# Altium schematic sheet sintez4355.SchDoc: Синтезатор 4355
size 840 x 594 mm; ApprovedBy: Демьяненко; CheckedBy: Быкадоров; Author: Юдин; DrawnBy: Юдин; Engineer: Нач. сек.; DocumentNumber: ЛБИЮ.0006 Э3; SheetTotal: 1; PageSetup: Record=PageOptions|CenterHorizontal=False|CenterVertical=False|PrintScale=0.33|XCorrection=0.00|YCorrection=0.00|PrintKind=1|BorderSize=5000000|LeftOffset=0|BottomOffset=0|Orientation=1|PaperLength=1000|PaperWidth=1000|Scale=100|PaperSource=15|PrintQuality=600|MediaType=1|DitherType=10|PaperKind=A4|PrintScaleMode=1; EngineerName: Быкадоров; DocumentType1str: Схема электрическая; DocumentType2str: принципиальная; NachKonstrSekt: Деплова; NachSektNadezn: Сагакянц; NachPodrVydTz: Бутко; ZamPoKonstr: Беликов; CRC32: A0E1A165; Обозначение: ЛБИЮ.0006 Э3; DOC_ID: 24763; шифр заказа: "Пх"; Номер версии: 0; Имя файла: sintez4355.SchDoc; Место хранения рабочей копии: E:\PROJECTS\SVN ФОРМИРОВАТЕЛИ ЧАСТОТЫ МИКРАН\MIKRAN 3; Владелец: Юдин Д.Г.; Дата создания документа: 26.01.2018; Тип документа: Э3 Схема электрическая Altium; Тип документа1: Cхема электрическая принципиальная; Архив: 2931; Масса: 0; Единица измерения: кг; Раздел СП: Документация; Статус ОТД: Не зарегистрирован; Наименование: Синртезатор 4355; ImagePath: ЛБИЮ.464345.028; Rule: PcbType=ProtelPcb
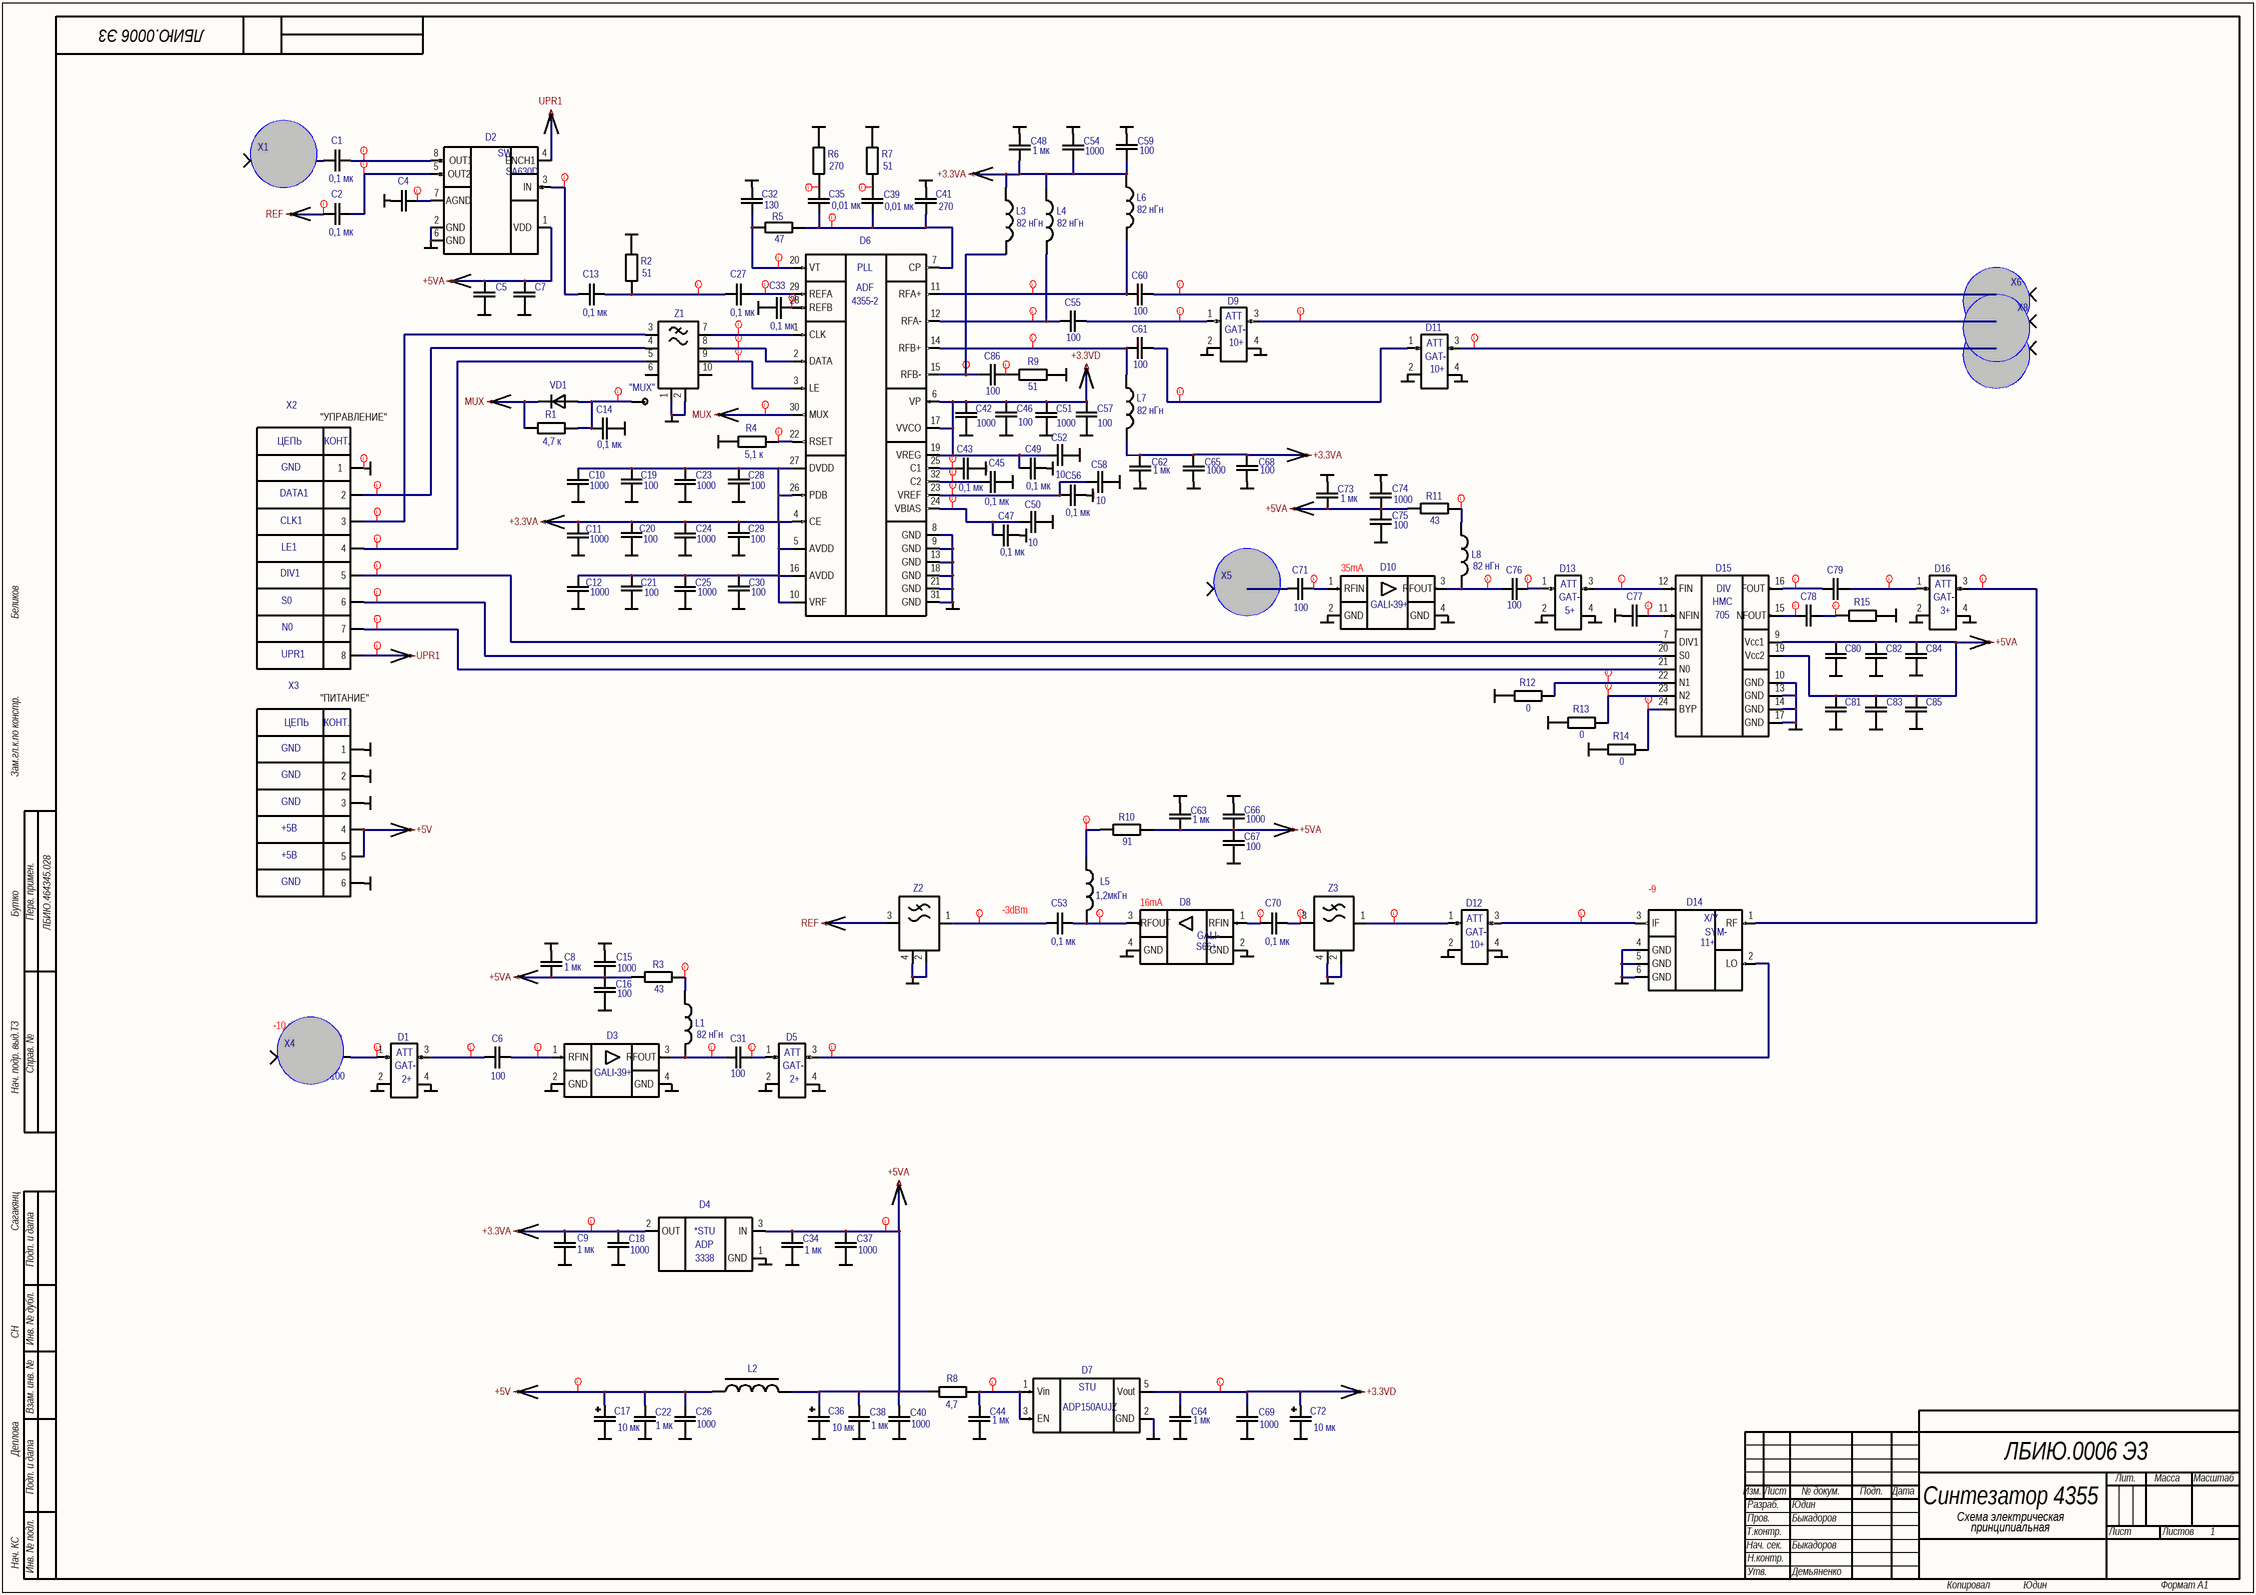
[diagram p0: sintez4355.SchDoc]

## Parts
(Parts that share a designator on the sheet are numbered #1, #2 ... from top to bottom, then left to right.)
1  TP  [TP0.3]  (value not drawn)  (no BOM)
*#1  VCC  (value not drawn)  (graphical)
*#2  GND  (value not drawn)  (graphical)
*#3  GND  (value not drawn)  (graphical)
*#4  GND  (value not drawn)  (graphical)
*#5  GND  (value not drawn)  (graphical)
*#6  GND  (value not drawn)  (graphical)
*#7  VCC  (value not drawn)  (graphical)
*#8  GND  (value not drawn)  (graphical)
*#9  GND  (value not drawn)  (graphical)
*#10  GND  (value not drawn)  (graphical)
*#11  VCC  (value not drawn)  (graphical)
*#12  GND  (value not drawn)  (graphical)
*#13  GND  (value not drawn)  (graphical)
*#14  VCC  (value not drawn)  (graphical)
*#15  GND  (value not drawn)  (graphical)
*#16  GND  (value not drawn)  (graphical)
*#17  GND  (value not drawn)  (graphical)
*#18  GND  (value not drawn)  (graphical)
*#19  GND  (value not drawn)  (graphical)
*#20  VCC  (value not drawn)  (graphical)
*#21  GND  (value not drawn)  (graphical)
*#22  GND  (value not drawn)  (graphical)
*#23  GND  (value not drawn)  (graphical)
*#24  VCC  (value not drawn)  (graphical)
*#25  GND  (value not drawn)  (graphical)
*#26  VCC  (value not drawn)  (graphical)
*#27  GND  (value not drawn)  (graphical)
*#28  GND  (value not drawn)  (graphical)
*#29  GND  (value not drawn)  (graphical)
*#30  GND  (value not drawn)  (graphical)
*#31  GND  (value not drawn)  (graphical)
*#32  GND  (value not drawn)  (graphical)
*#33  GND  (value not drawn)  (graphical)
*#34  VCC  (value not drawn)  (graphical)
*#35  GND  (value not drawn)  (graphical)
*#36  GND  (value not drawn)  (graphical)
*#37  GND  (value not drawn)  (graphical)
*#38  GND  (value not drawn)  (graphical)
*#39  GND  (value not drawn)  (graphical)
*#40  GND  (value not drawn)  (graphical)
*#41  GND  (value not drawn)  (graphical)
*#42  GND  (value not drawn)  (graphical)
*#43  GND  (value not drawn)  (graphical)
*#44  GND  (value not drawn)  (graphical)
*#45  GND  (value not drawn)  (graphical)
*#46  GND  (value not drawn)  (graphical)
*#47  GND  (value not drawn)  (graphical)
*#48  GND  (value not drawn)  (graphical)
*#49  GND  (value not drawn)  (graphical)
*#50  VCC  (value not drawn)  (graphical)
*#51  VCC  (value not drawn)  (graphical)
*#52  GND  (value not drawn)  (graphical)
*#53  GND  (value not drawn)  (graphical)
*#54  GND  (value not drawn)  (graphical)
*#55  GND  (value not drawn)  (graphical)
*#56  GND  (value not drawn)  (graphical)
*#57  GND  (value not drawn)  (graphical)
*#58  GND  (value not drawn)  (graphical)
*#59  GND  (value not drawn)  (graphical)
*#60  GND  (value not drawn)  (graphical)
*#61  GND  (value not drawn)  (graphical)
*#62  GND  (value not drawn)  (graphical)
*#63  GND  (value not drawn)  (graphical)
*#64  GND  (value not drawn)  (graphical)
*#65  GND  (value not drawn)  (graphical)
*#66  GND  (value not drawn)  (graphical)
*#67  GND  (value not drawn)  (graphical)
*#68  GND  (value not drawn)  (graphical)
*#69  GND  (value not drawn)  (graphical)
*#70  GND  (value not drawn)  (graphical)
*#71  GND  (value not drawn)  (graphical)
*#72  VCC  (value not drawn)  (graphical)
*#73  VCC  (value not drawn)  (graphical)
*#74  GND  (value not drawn)  (graphical)
*#75  GND  (value not drawn)  (graphical)
*#76  GND  (value not drawn)  (graphical)
*#77  GND  (value not drawn)  (graphical)
*#78  GND  (value not drawn)  (graphical)
*#79  GND  (value not drawn)  (graphical)
*#80  GND  (value not drawn)  (graphical)
*#81  GND  (value not drawn)  (graphical)
*#82  GND  (value not drawn)  (graphical)
*#83  GND  (value not drawn)  (graphical)
*#84  GND  (value not drawn)  (graphical)
*#85  GND  (value not drawn)  (graphical)
*#86  GND  (value not drawn)  (graphical)
*#87  GND  (value not drawn)  (graphical)
*#88  GND  (value not drawn)  (graphical)
*#89  VCC  (value not drawn)  (graphical)
*#90  VCC  (value not drawn)  (graphical)
*#91  GND  (value not drawn)  (graphical)
*#92  GND  (value not drawn)  (graphical)
*#93  VCC  (value not drawn)  (graphical)
*#94  GND  (value not drawn)  (graphical)
*#95  GND  (value not drawn)  (graphical)
*#96  GND  (value not drawn)  (graphical)
*#97  GND  (value not drawn)  (graphical)
*#98  GND  (value not drawn)  (graphical)
*#99  GND  (value not drawn)  (graphical)
*#100  VCC  (value not drawn)  (graphical)
*#101  GND  (value not drawn)  (graphical)
*#102  GND  (value not drawn)  (graphical)
*#103  GND  (value not drawn)  (graphical)
*#104  GND  (value not drawn)  (graphical)
*#105  GND  (value not drawn)  (graphical)
*#106  GND  (value not drawn)  (graphical)
*#107  GND  (value not drawn)  (graphical)
*#108  GND  (value not drawn)  (graphical)
*#109  GND  (value not drawn)  (graphical)
*#110  GND  (value not drawn)  (graphical)
*#111  VCC  (value not drawn)  (graphical)
*#112  VCC  (value not drawn)  (graphical)
*#113  GND  (value not drawn)  (graphical)
*#114  GND  (value not drawn)  (graphical)
*#115  GND  (value not drawn)  (graphical)
*#116  GND  (value not drawn)  (graphical)
*#117  GND  (value not drawn)  (graphical)
*#118  VCC  (value not drawn)  (graphical)
*#119  VCC  (value not drawn)  (graphical)
*#120  GND  (value not drawn)  (graphical)
*#121  GND  (value not drawn)  (graphical)
*#122  GND  (value not drawn)  (graphical)
*#123  GND  (value not drawn)  (graphical)
*#124  GND  (value not drawn)  (graphical)
*#125  GND  (value not drawn)  (graphical)
*#126  GND  (value not drawn)  (graphical)
*#127  GND  (value not drawn)  (graphical)
*#128  GND  (value not drawn)  (graphical)
*#129  GND  (value not drawn)  (graphical)
*#130  GND  (value not drawn)  (graphical)
C1  0,1 мк  [CAPC1608L]
C2  0,1 мк  [CAPC1608L]
C3  100  [CAPC1608L]
C4  0,1 мк  [CAPC1608L]  (value not drawn)
C5  1000  [CAPC1608L]  (value not drawn)
C6  100  [CAPC1608L]
C7  1 мк  [CAPC2012L]  (value not drawn)
C8  1 мк  [CAPC2012L]
C9  1 мк  [CAPC2012L]
C10  1000  [CAPC1608L]
C11  1000  [CAPC1608L]
C12  1000  [CAPC1608L]
C13  0,1 мк  [CAPC1608L]
C14  0,1 мк  [CAPC1608L]
C15  1000  [CAPC1608L]
C16  100  [CAPC1608L]
C17  10 мк  [TC3216-1206]
C18  1000  [CAPC1608L]
C19  100  [CAPC1608L]
C20  100  [CAPC1608L]
C21  100  [CAPC1608L]
C22  1 мк  [CAPC2012L]
C23  1000  [CAPC1608L]
C24  1000  [CAPC1608L]
C25  1000  [CAPC1608L]
C26  1000  [CAPC1608L]
C27  0,1 мк  [CAPC1608L]
C28  100  [CAPC1608L]
C29  100  [CAPC1608L]
C30  100  [CAPC1608L]
C31  100  [CAPC1608L]
C32  130  [CAPC1608L]
C33  0,1 мк  [CAPC1608L]
C34  1 мк  [CAPC2012L]
C35  0,01 мк  [CAPC1608L]
C36  10 мк  [TC3216-1206]
C37  1000  [CAPC1608L]
C38  1 мк  [CAPC2012L]
C39  0,01 мк  [CAPC1608L]
C40  1000  [CAPC1608L]
C41  270  [CAPC1608L]
C42  1000  [CAPC1608L]
C43  0,1 мк  [CAPC1608L]
C44  1 мк  [CAPC2012L]
C45  0,1 мк  [CAPC1608L]
C46  100  [CAPC1608L]
C47  0,1 мк  [CAPC1608L]
C48  1 мк  [CAPC2012L]
C49  0,1 мк  [CAPC1608L]
C50  10  [CAPC1608L]
C51  1000  [CAPC1608L]
C52  10  [CAPC1608L]
C53  0,1 мк  [CAPC1608L]
C54  1000  [CAPC1608L]
C55  100  [CAPC1608L]
C56  0,1 мк  [CAPC1608L]
C57  100  [CAPC1608L]
C58  10  [CAPC1608L]
C59  100  [CAPC1608L]
C60  100  [CAPC1608L]
C61  100  [CAPC1608L]
C62  1 мк  [CAPC2012L]
C63  1 мк  [CAPC2012L]
C64  1 мк  [CAPC2012L]
C65  1000  [CAPC1608L]
C66  1000  [CAPC1608L]
C67  100  [CAPC1608L]
C68  100  [CAPC1608L]
C69  1000  [CAPC1608L]
C70  0,1 мк  [CAPC1608L]
C71  100  [CAPC1608L]
C72  10 мк  [TC3216-1206]
C73  1 мк  [CAPC2012L]
C74  1000  [CAPC1608L]
C75  100  [CAPC1608L]
C76  100  [CAPC1608L]
C77  100  [CAPC1608L]  (value not drawn)
C78  100  [CAPC1608L]  (value not drawn)
C79  100  [CAPC1608L]  (value not drawn)
C80  1000  [CAPC1608L]  (value not drawn)
C81  1000  [CAPC1608L]  (value not drawn)
C82  100  [CAPC1608L]  (value not drawn)
C83  100  [CAPC1608L]  (value not drawn)
C84  10 мк  [CAPC2012L]  (value not drawn)
C85  10 мк  [CAPC2012L]  (value not drawn)
C86  100  [CAPC1608L]
D1  (no value)  [MW_GAT-0]
D2  SA630D/01  [SOIC127P600-8M]  (value not drawn)
D3  GALI-39+  [SOT89-150P400X160-3N]  (value not drawn)
D4  ADP3338AKCZ-3.3-RL  [SOT230P700X180-4N]  (value not drawn)
D5  (no value)  [MW_GAT-0]
D6  ADF4355-2BCPZ  [QFN50P500X500X80-33N]  (value not drawn)
D7  ADP150AUJZ-3.3-R7  [SOT95P280X100-5N]  (value not drawn)
D8  GALI-S66+  [SOT89-150P400X160-3N]  (value not drawn)
D9  (no value)  [MW_GAT-0]
D10  GALI-39+  [SOT89-150P400X160-3N]  (value not drawn)
D11  (no value)  [MW_GAT-0]
D12  (no value)  [MW_GAT-0]
D13  (no value)  [MW_GAT-0]
D14  SYM-11+  [MW_SYM-25DLHW]  (value not drawn)
D15  HMC705LP4E  [QFN50P400X400X100_HS280x280-25N]  (value not drawn)
D16  (no value)  [MW_GAT-0]
L1  82 нГн  [INDC1608L]
L2  47мкГн  [MSS6132]  (value not drawn)
L3  82 нГн  [INDC1608L]
L4  82 нГн  [INDC1608L]
L5  1,2мкГн  [INDC4532L]
L6  82 нГн  [INDC1608L]
L7  82 нГн  [INDC1608L]
L8  82 нГн  [INDC1608L]
R1  4,7 к  [RESC1608L]
R2  51  [RESC1608L]
R3  43  [RESC2012L]
R4  5,1 к  [RESC1608L]
R5  47  [RESC1608L]
R6  270  [RESC1608L]
R7  51  [RESC1608L]
R8  4,7  [RESC1608L]
R9  51  [RESC1608L]
R10  91  [RESC2012L]
R11  43  [RESC2012L]
R12  0  [RESC1005L]
R13  0  [RESC1005L]
R14  0  [RESC1005L]
R15  51  [RESC1608L]  (value not drawn)
VD1  PMLL4148  [DIOMELF3515N]  (value not drawn)
X1  22_SMA-50-0-15/111_NE  [TP0.8X1.5]  (value not drawn)
X2  PLD-8  [PLD-8]  (value not drawn)
X3  PLD2-6  [PLD2-6]  (value not drawn)
X4  22_SMA-50-0-15/111_NE  [TP0.8X1.5]  (value not drawn)
X5  22_SMA-50-0-15/111_NE  [TP0.8X1.5]  (value not drawn)
X6  22_SMA-50-0-15/111_NE  [TP0.8X1.5]  (value not drawn)
X7  22_SMA-50-0-15/111_NE  [TP0.8X1.5]  (value not drawn)
X8  22_SMA-50-0-15/111_NE  [TP0.8X1.5]  (value not drawn)
Z1  NFA31GD1011014  [FIL_NFA31G]  (value not drawn)
Z2  LFCN-95+  [FIL_3216x9.4]  (value not drawn)
Z3  LFCN-95+  [FIL_3216x9.4]  (value not drawn)

## Nets
+3.3VA: C9.2 C10.2 C11.2 C12.2 C18.2 C19.2 C20.2 C21.2 C23.2 C24.2 C25.2 C28.2 C29.2 C30.2 C48.1 C54.1 C59.1 C62.1 C65.1 C68.1 D4.2(OUT) D6.4(CE) D6.5(AVDD) D6.10(VRF) D6.16(AVDD) D6.26(PDB) D6.27(DVDD) L3.1 L4.1 L6.1 L7.2
+3.3VD: C42.2 C46.2 C49.1 C51.2 C52.2 C57.2 C64.2 C69.2 C72.2 D6.6(VP) D6.17(VVCO) D6.19(VREG) D7.5(Vout)
+5V: C17.2 C22.2 C26.2 L2.1 X3.4 X3.5
+5VA: C5.2 C7.2 C8.1 C15.1 C16.2 C34.2 C36.2 C37.2 C38.2 C40.2 C63.1 C66.1 C67.2 C73.1 C74.1 C75.2 C80.2 C81.2 C82.2 C83.2 C84.2 C85.2 D2.1(VDD) D4.3(IN) D15.9(Vcc1) D15.19(Vcc2) L2.2 R3.2 R8.1 R10.1 R11.2
GND: C4.2 C5.1 C7.1 C8.2 C9.1 C10.1 C11.1 C12.1 C14.1 C15.2 C16.1 C17.1 C18.1 C19.1 C20.1 C21.1 C22.1 C23.1 C24.1 C25.1 C26.1 C28.1 C29.1 C30.1 C32.2 C33.1 C34.1 C36.1 C37.1 C38.1 C40.1 C41.2 C42.1 C43.1 C44.1 C45.1 C46.1 C47.2 C48.2 C49.2 C50.1 C51.1 C52.1 C54.2 C56.2 C57.1 C58.1 C59.2 C62.2 C63.2 C64.1 C65.2 C66.2 C67.1 C68.2 C69.1 C72.1 C73.2 C74.2 C75.1 C77.2 C80.1 C81.1 C82.1 C83.1 C84.1 C85.1 D1.2(GND) D1.4(GND) D2.2(GND) D2.6(GND) D3.2(GND) D3.4(GND) D4.1(GND) D5.2(GND) D5.4(GND) D6.8(GND) D6.9(GND) D6.13(GND) D6.18(GND) D6.21(GND) D6.31(GND) D6.EPAD(GND) D7.2(GND) D8.2(GND) D8.4(GND) D9.2(GND) D9.4(GND) D10.2(GND) D10.4(GND) D11.2(GND) D11.4(GND) D12.2(GND) D12.4(GND) D13.2(GND) D13.4(GND) D14.4(GND) D14.5(GND) D14.6(GND) D15.10(GND) D15.13(GND) D15.14(GND) D15.17(GND) D15.EPAD D16.2(GND) D16.4(GND) R2.2 R4.1 R6.2 R7.2 R9.1 R12.1 R13.1 R14.1 R15.2 X2.1 X3.1 X3.2 X3.3 X3.6 Z1.1(GND) Z1.2(GND) Z2.2(Ground) Z2.4(Ground) Z3.2(Ground) Z3.4(Ground)
MUX: D6.30(MUX) R1.1 VD1.2(Cathode)
REF: C2.1 Z2.3(Out)
UPR1: D2.4(ENCH1) X2.8
Net1_1: 1.1 C14.2 R1.2 VD1.1(Anode)
NetC1_1: C1.1 X1.1
NetC1_2: C1.2 D2.8(OUT1)
NetC2_2: C2.2 D2.5(OUT2)
NetC3_1: C3.1 X4.1
NetC3_2: C3.2 D1.1(IN)
NetC4_1: C4.1 D2.7(AGND)
NetC6_1: C6.1 D1.3(OUT)
NetC6_2: C6.2 D3.1(RFIN)
NetC13_1: C13.1 D2.3(IN)
NetC13_2: C13.2 C27.1 R2.1
NetC27_2: C27.2 D6.29(REFA)
NetC31_1: C31.1 D5.1(IN)
NetC31_2: C31.2 D3.3(RFOUT) L1.2
NetC32_1: C32.1 D6.20(VT) R5.2
NetC33_2: C33.2 D6.28(REFB)
NetC35_1: C35.1 C39.1 C41.1 D6.7(CP) R5.1
NetC35_2: C35.2 R6.1
NetC39_2: C39.2 R7.1
NetC43_2: C43.2 D6.25(C1)
NetC44_2: C44.2 D7.1(Vin) D7.3(EN) R8.2
NetC45_2: C45.2 D6.32(C2)
NetC47_1: C47.1 C50.2 D6.24(VBIAS)
NetC53_1: C53.1 Z2.1(In)
NetC53_2: C53.2 D8.3(RFOUT) L5.2
NetC55_1: C55.1 D6.12(RFA-) L4.2
NetC55_2: C55.2 D9.1(IN)
NetC56_1: C56.1 C58.2 D6.23(VREF)
NetC60_1: C60.1 D6.11(RFA+) L6.2
NetC60_2: C60.2 X6.1
NetC61_1: C61.1 D6.14(RFB+) L7.1
NetC61_2: C61.2 D11.1(IN)
NetC70_1: C70.1 D8.1(RFIN)
NetC70_2: C70.2 Z3.3(Out)
NetC71_1: C71.1 X5.1
NetC71_2: C71.2 D10.1(RFIN)
NetC76_1: C76.1 D13.1(IN)
NetC76_2: C76.2 D10.3(RFOUT) L8.2
NetC77_1: C77.1 D15.11(NFIN)
NetC78_1: C78.1 R15.1
NetC78_2: C78.2 D15.15(NFOUT)
NetC79_1: C79.1 D16.1(IN)
NetC79_2: C79.2 D15.16(FOUT)
NetC86_1: C86.1 D6.15(RFB-) L3.2
NetC86_2: C86.2 R9.2
NetD5_3: D5.3(OUT) D14.2(LO)
NetD6_1: D6.1(CLK) Z1.7
NetD6_2: D6.2(DATA) Z1.8
NetD6_3: D6.3(LE) Z1.9
NetD6_22: D6.22(RSET) R4.2
NetD9_3: D9.3(OUT) X8.1
NetD11_3: D11.3(OUT) X7.1
NetD12_1: D12.1(IN) Z3.1(In)
NetD12_3: D12.3(OUT) D14.3(IF)
NetD13_3: D13.3(OUT) D15.12(FIN)
NetD14_1: D14.1(RF) D16.3(OUT)
NetD15_7: D15.7(DIV1) X2.5
NetD15_20: D15.20(S0) X2.6
NetD15_21: D15.21(N0) X2.7
NetD15_22: D15.22(N1) R12.2
NetD15_23: D15.23(N2) R13.2
NetD15_24: D15.24(BYP) R14.2
NetL1_1: L1.1 R3.1
NetL5_1: L5.1 R10.2
NetL8_1: L8.1 R11.1
NetX2_2: X2.2 Z1.4
NetX2_3: X2.3 Z1.3
NetX2_4: X2.4 Z1.5

Not connected (* = marked no-connect by the designer): D7 4(NC); D15 1(N/C) 2(N/C) 3(N/C) 4(N/C) 5(N/C) 6(N/C) 8(N/C) 18(N/C); Z1 6 10

## Layout directives
net class GND: GND
net class HF-Band: NetC1_1, NetC1_2, NetC2_2, NetC4_1, NetC13_1, NetC13_2, NetC27_2, NetC33_2, NetC53_1, NetC53_2, NetC70_1, NetC70_2, NetD12_1, NetD12_3, REF
net class LF-Band: NetC32_1, NetC35_1, NetC35_2, NetC39_2
net class Power: +3.3VA, +3.3VD, +5V, +5VA, NetC43_2, NetC44_2, NetC45_2, NetC47_1, NetC56_1, NetD6_22, NetL1_1, NetL5_1, NetL8_1
net class Control: MUX, Net1_1, NetD6_1, NetD6_2, NetD6_3, NetD15_7, NetD15_20, NetD15_21, NetD15_22, NetD15_23, NetD15_24, NetX2_2, NetX2_3, NetX2_4, UPR1
net class SHF-Band: NetC3_1, NetC3_2, NetC6_1, NetC6_2, NetC31_1, NetC31_2, NetC55_1, NetC55_2, NetC60_1, NetC60_2, NetC61_1, NetC61_2, NetC71_1, NetC71_2, NetC76_1, NetC76_2, NetC77_1, NetC78_1, NetC78_2, NetC79_1, NetC79_2, NetC86_1, NetC86_2, NetD5_3, NetD9_3, NetD11_3, NetD13_3, NetD14_1

## Notes on the sheet
- (near D9) 10+
- (near D11) 10+
- (near Z1) "MUX"
- "УПРАВЛЕНИЕ"
- GND
- DATA1
- CLK1
- LE1
- DIV1
- (near D10) 35mA
- S0
- (near D13) 5+
- (near D16) 3+
- N0
- UPR1
- "ПИТАНИЕ"
- +5В
- -3dBm
- (near D8) 16mA
- (near D14) -9
- (near D12) 10+
- -10 dBm
- (near D1) 2+
- (near D5) 2+
- Зам.гл.к.по констр.
- Перв. примен.
- Нач. подр. выд.ТЗ
- Справ. №
- Подп. и дата
- СН
- Инв. № дубл.
- Взам. инв. №
- Изм.
- Лист
- № докум.
- Подп.
- Дата
- Лит.
- Масса
- Масштаб
- Т.контр.
- Пров.
- Разраб.
- Листов
- Нач. КС
- Инв. № подл.
- Н.контр.
- Утв.
- Копировал
- Формат А1
- (in symbol ADF4355-2BCPZ) PLL; ADF; 4355-2
- (in symbol ADP150AUJZ) STU
- (in symbol ADP3338AKCZ-3.3-RL) *STU; ADP; 3338
- (in symbol GALI-S66+) GALI-; S66+
- (in symbol GAT) ATT; GAT-
- (in symbol HMC705LP4E) DIV; HMC; 705
- (in symbol PLD2-6) ЦЕПЬ; КОНТ.
- (in symbol PLD-8) ЦЕПЬ; КОНТ.
- (in symbol SA630D) SW
- (in symbol SYM-11+) X/Y; SYM-; 11+

## Library data of the parts
1 = TP: Test point
*#1 *#7 *#11 *#14 *#20 *#24 *#26 *#34 *#50 *#51 *#72 *#73 *#89 *#90 *#93 *#100 *#111 *#112 *#118 *#119 = VCC: Порт ЕСКД. Для "наложения" на штатный Power Bar
*#2-*#6 *#8-*#10 *#12 *#13 *#15-*#19 *#21-*#23 *#25 *#27-*#33 *#35-*#49 *#52-*#71 *#74-*#88 *#91 *#92 *#94-*#99 *#101-*#110 *#113-*#117 *#120-*#130 = GND: Корпус ЕСКД. Для "наложения" на штатный Power Bar
C1 C2 C4 C13 C14 C27 C33 C43 C45 C47 C49 C53 C56 C70 = i6124B5A08701E000001: Чип-конденсатор; ManufacturerPartNumber: 0603 X7R 0,1 мкФ ±10 % 50 В; Name: 0603; Power/Voltage: 50 В; TKE/TKC: {TKE/TKC}; Tolerance: ±10 %; PCADSymbol: C; PCADLibrary: PASSIV.LIB; BCPId: *; Manufacturer: *; Type: Конденсатор; Value: 0,1 мк; ImKey: i6124B5A08701E000001; PCADType: C0603; PCADPattern: C0603
C3 C6 C16 C19-C21 C28-C31 C46 C55 C57 C59-C61 C67 C68 C71 C75-C79 C82 C83 C86 = i6124B5A08701A000014: Чип-конденсатор; ManufacturerPartNumber: 0603 NP0 100 пФ ±5 % 50 В; Name: 0603; Power/Voltage: 50 В; TKE/TKC: NP0; Tolerance: ±5 %; BCPId: *; Manufacturer: *; Type: Конденсатор; Value: 100; ImKey: i6124B5A08701A000014
C5 C10-C12 C15 C18 C23-C26 C37 C40 C42 C51 C54 C65 C66 C69 C74 = i6124B5A08701A000008: Чип-конденсатор; ManufacturerPartNumber: 0603 NP0 1000 пФ ±5 % 50 В; Name: 0603; Power/Voltage: 50 В; TKE/TKC: {TKE/TKC}; Tolerance: ±5 %; PCADSymbol: C; PCADLibrary: PASSIV.LIB; BCPId: *; Manufacturer: *; Type: Конденсатор; Value: 1000; ImKey: i6124B5A08701A000008; PCADType: C0603; PCADPattern: C0603
C7-C9 C22 C34 C38 C44 C48 C62-C64 C73 = i6124B5A0870C4000011: Чип-конденсатор; ManufacturerPartNumber: 0805 X7R 1 мкФ ±10 % 50 В; Name: 0805; Power/Voltage: 50 В; TKE/TKC: {TKE/TKC}; Tolerance: ±10 %; PCADSymbol: C; PCADLibrary: PASSIV.LIB; BCPId: *; Manufacturer: *; Type: Конденсатор; Value: 1 мк; ImKey: i6124B5A0870C4000011; PCADType: C0805; PCADPattern: C0805
C17 C36 C72 = i6124B5A087028000006: Танталовый конденсатор; ManufacturerPartNumber: TAJA106M016RNJ (10 мкФ ±20 % 16 В); Power/Voltage: 16 В; Tolerance: ±20 %; PCADSymbol: TAJ; PCADLibrary: PASSIV.LIB; BCPId: *; Manufacturer: *; Name: TAJA; TKE/TKC: *; Type: Конденсатор; Value: 10 мк; ImKey: i6124B5A087028000006; PCADType: TAJA; PCADPattern: TAJA
C32 = i6124B5A08701A00002D: Чип-конденсатор; ManufacturerPartNumber: 0603 NP0 130 пФ ±5 % 50 В; Name: 0603; Power/Voltage: 50 В; TKE/TKC: {TKE/TKC}; Tolerance: ±5 %; PCADSymbol: C; PCADLibrary: PASSIV.LIB; BCPId: *; Manufacturer: *; Type: Конденсатор; Value: 130; ImKey: i6124B5A08701A00002D; PCADType: C0603; PCADPattern: C0603
C35 C39 = i6124B5A08701E000002: Чип-конденсатор; ManufacturerPartNumber: 0603 X7R 0,01 мкФ ±10 % 50 В; Name: 0603; Power/Voltage: 50 В; TKE/TKC: {TKE/TKC}; Tolerance: ±10 %; PCADSymbol: C; PCADLibrary: PASSIV.LIB; BCPId: *; Manufacturer: *; Type: Конденсатор; Value: 0,01 мк; ImKey: i6124B5A08701E000002; PCADType: C0603; PCADPattern: C0603
C41 = i6124B5A08701A00002C: Чип-конденсатор; ManufacturerPartNumber: 0603 NP0 270 пФ ±5 % 50 В; Name: 0603; Power/Voltage: 50 В; TKE/TKC: {TKE/TKC}; Tolerance: ±5 %; PCADSymbol: C; PCADLibrary: PASSIV.LIB; BCPId: *; Manufacturer: *; Type: Конденсатор; Value: 270; ImKey: i6124B5A08701A00002C; PCADType: C0603; PCADPattern: C0603
C50 C52 C58 = i6124B5A08701A000016: Чип-конденсатор; ManufacturerPartNumber: 0603 NP0 10 пФ ±5 % 50 В; Name: 0603; Power/Voltage: 50 В; TKE/TKC: {TKE/TKC}; Tolerance: ±5 %; PCADSymbol: C; PCADLibrary: PASSIV.LIB; BCPId: *; Manufacturer: *; Type: Конденсатор; Value: 10; ImKey: i6124B5A08701A000016; PCADType: C0603; PCADPattern: C0603
C80 C81 = i6124B5A08701A000008: Чип-конденсатор; ManufacturerPartNumber: 0603 NP0 1000 пФ ±5 % 50 В; Name: 0603; Power/Voltage: 50 В; TKE/TKC: NP0; Tolerance: ±5 %; BCPId: *; Manufacturer: *; Type: Конденсатор; Value: 1000; ImKey: i6124B5A08701A000008
C84 C85 = i6124B5A087046000001: Чип-конденсатор; ManufacturerPartNumber: 0805 Y5V 10 мкФ +80/-20 % 16 В; Name: 0805; Power/Voltage: 16 В; TKE/TKC: Y5V; Tolerance: +80/-20 %; PCADSymbol: C; PCADLibrary: PASSIV.LIB; BCPId: *; Manufacturer: *; Type: Конденсатор; Value: 10 мк; ImKey: i6124B5A087046000001; PCADType: C0805; PCADPattern: C0805
D1 D5 = GAT: Fixed attenuator DC-8000; Manufacturer: Mini-Circuits; ManufacturerPartNumber: GAT-2+; Type: Микросхема; BCPId: *; Name: *; Package: FG873
D2 = SA630D: Single-Pole Double-Throw (SPDT) switch; Manufacturer*: NXP; Type: Микросхема; BCPId: *; ManufacturerPartNumber: SA630D/01; Package: SO8
D3 D10 = GALI-39+: Monolithic Amplifier 50Ω      DC to 7 GHz; Manufacturer: Mini-Circuits; Type: Микросхема; BCPId: *; Name: *; Package: DF782; ManufacturerPartNumber: GALI-39+
D4 = ADP3338AKCZ-3.3-RL: High Accuracy, Ultralow IQ, 1 A, anyCAP ® Low Dropout Regulator; Manufacturer: Analog Devices; Type: Микросхема; BCPId: *; Name: *; Package: SOT-223; ManufacturerPartNumber: ADP3338AKCZ-3.3-RL
D6 = ADF4355-2BCPZ: Wideband Synthesizer with Integrated VCO 54 MHz to 4400 MHz; Manufacturer: Analog Devices; Type: Микросхема; BCPId: *; Name: *; Package: CP-32-12; ManufacturerPartNumber: ADF4355-2BCPZ; HelpURL: *; Price: *; Rem: *; TU/GOST: *
D7 = ADP150AUJZ: 150 mA CMOS Linear Regulator; Manufacturer: Analog Devices; Type: Микросхема; BCPId: *; Package: UJ-5; Tolerance: *; ManufacturerPartNumber: ADP150AUJZ-3.3-R7
D8 = GALI-S66+: Monolithic Amplifier 50Ω      DC to 3 GHz; Manufacturer: Mini-Circuits; Type: Микросхема; BCPId: *; Name: *; Package: DF782; ManufacturerPartNumber: GALI-S66+
D9 D11 D12 = GAT: Fixed attenuator DC-8000; Manufacturer: Mini-Circuits; ManufacturerPartNumber: GAT-10+; Type: Микросхема; BCPId: *; Name: *; Package: FG873
D13 = GAT: Fixed attenuator DC-8000; Manufacturer: Mini-Circuits; ManufacturerPartNumber: GAT-5+; Type: Микросхема; BCPId: *; Name: *; Package: FG873
D14 = SYM-11+: Frequency Mixer 1 to 2500 MHz; Manufacturer: Mini-Circuits; Type: Микросхема; BCPId: *; Name: *; Package: TTT167; ManufacturerPartNumber: SYM-11+
D15 = HMC705LP4E: 6.5 GHz PROGRAMMABLE DIVIDER; Manufacturer: Hittite; Type: Микросхема; BCPId: *; ManufacturerPartNumber: HMC705LP4E; Name: *; Package: LP4
D16 = GAT: Fixed attenuator DC-8000; Manufacturer: Mini-Circuits; ManufacturerPartNumber: GAT-3+; Type: Микросхема; BCPId: *; Name: *; Package: FG873
L1 L3 L4 L6-L8 = L0603: Индуктивность без магнитопровода; Manufacturer: CoilCraft; ManufacturerPartNumber: 0603CS-82NXJE (82 нГн ±5 %); Name: 0603; Tolerance: 5%; Value: 82нГн; BCPId: *; Package: *; Type: Индуктивность
L2 = MSS6132: Дроссель; Manufacturer: Coilcraft; ManufacturerPartNumber: MSS6132-473ML (47 мкГн ±20 % 0,86 А); Tolerance: 20%; BCPId: *; Name: *; Package: MSS6132; Type: Дроссель; Value: 47мкГн
L5 = L1812: Индуктивность без магнитопровода; Manufacturer: CoilCraft; ManufacturerPartNumber: 1812CS-122XJL (1,2 мкГн ±5 %); Name: 1812; Tolerance: ±5 %; BCPId: *; Package: *; Type: Индуктивность; Value: 1,2мкГн
R1 = i6124B5A087119000003: Чип-резистор; ManufacturerPartNumber: 0603 4,7 кОм ±5 %; Name: 0603; Tolerance: ±5 %; Power/Voltage: 0,063 Вт; BCPId: *; Manufacturer: *; Type: Резистор; Value: 4,7 к; ImKey: i6124B5A087119000003
R2 R7 R9 R15 = i6124B5A087098000006: Чип-резистор; ManufacturerPartNumber: 0603 51 Ом ±5 %; Name: 0603; Tolerance: ±5 %; Power/Voltage: 0,067 Вт; BCPId: *; Manufacturer: *; Type: Резистор; Value: 51; ImKey: i6124B5A087098000006
R3 R11 = R0805: Чип-резистор; ManufacturerPartNumber: 0805 43 Ом ±5 %; Name: 0805; Tolerance: ±5 %; BCPId: *; Manufacturer: *; Type: Резистор; Value: 43
R4 = i6124B5A08711900000D: Чип-резистор; ManufacturerPartNumber: 0603 5,1 кОм ±5 %; Name: 0603; Tolerance: ±5 %; Power/Voltage: 0,063 Вт; BCPId: *; Manufacturer: *; Type: Резистор; Value: 5,1 к; ImKey: i6124B5A08711900000D
R5 = i6124B5A087098000006: Чип-резистор; ManufacturerPartNumber: 0603 47 Ом ±5 %; Name: 0603; Tolerance: ±5 %; Power/Voltage: 0,067 Вт; BCPId: *; Manufacturer: *; Type: Резистор; Value: 47; ImKey: i6124B5A087098000006
R6 = i6124B5A087098000006: Чип-резистор; ManufacturerPartNumber: 0603 270 Ом ±5 %; Name: 0603; Tolerance: ±5 %; Power/Voltage: 0,067 Вт; BCPId: *; Manufacturer: *; Type: Резистор; Value: 270; ImKey: i6124B5A087098000006
R8 = i6124B5A08711900004A: Чип-резистор; ManufacturerPartNumber: 0603 4,7 Ом ±5 %; Name: 0603; Tolerance: ±5 %; Power/Voltage: 0,063 Вт; BCPId: *; Manufacturer: *; Type: Резистор; Value: 4,7; ImKey: i6124B5A08711900004A
R10 = R0805: Чип-резистор; ManufacturerPartNumber: 0805 91 Ом ±5 %; Name: 0805; Tolerance: ±5 %; BCPId: *; Manufacturer: *; Type: Резистор; Value: 91
R12-R14 = i6124B5A08703F00000B: Чип-резистор; ManufacturerPartNumber: 0402 0 Ом; Name: 0402; Tolerance: ±5 %; Power/Voltage: 0,063 Вт; BCPId: *; Manufacturer: *; Type: Резистор; Value: 0; ImKey: i6124B5A08703F00000B
VD1 = PMLL4148: Диод; Manufacturer: NXP; ManufacturerPartNumber: PMLL4148L; BCPId: *; Name: *; Package: SOD80C; Type: Диод
X1 X4-X8 = 22_SMA-50-0-15/111_NE: Розетка герметичная; Manufacturer: HUBER+SUHNER; BCPId: *; ManufacturerPartNumber: 22_SMA-50-0-15/111_NE; Type: Розетка
X2 = PLD-8: Штыри на плату шаг 2.54мм., двухрядные; Manufacturer: Бурый Медведь; BCPId: *; ManufacturerPartNumber: PLD-8; Type: Розетка
X3 = PLD2-6: Штыри на плату, шаг 2.00мм., двухрядные; BCPId: *; ManufacturerPartNumber: PLD2-6; Rem: *; Package: *; Type: Вилка; HelpURL: *; Price: *
Z1 = NFA31G: RC Combined; Manufacturer*: Murata; BCPId: *; Type: Фильтр; ManufacturerPartNumber: NFA31GD1011014; Package: 1206
Z2 Z3 = LFCN: Low Pass Filter; Manufacturer: Mini-Circuits; BCPId: *; Package: FV1206; Tolerance: *; ManufacturerPartNumber: LFCN-95+; Type: Фильтр